# EAGLE design tower controller (EAGLE 9.6.2)
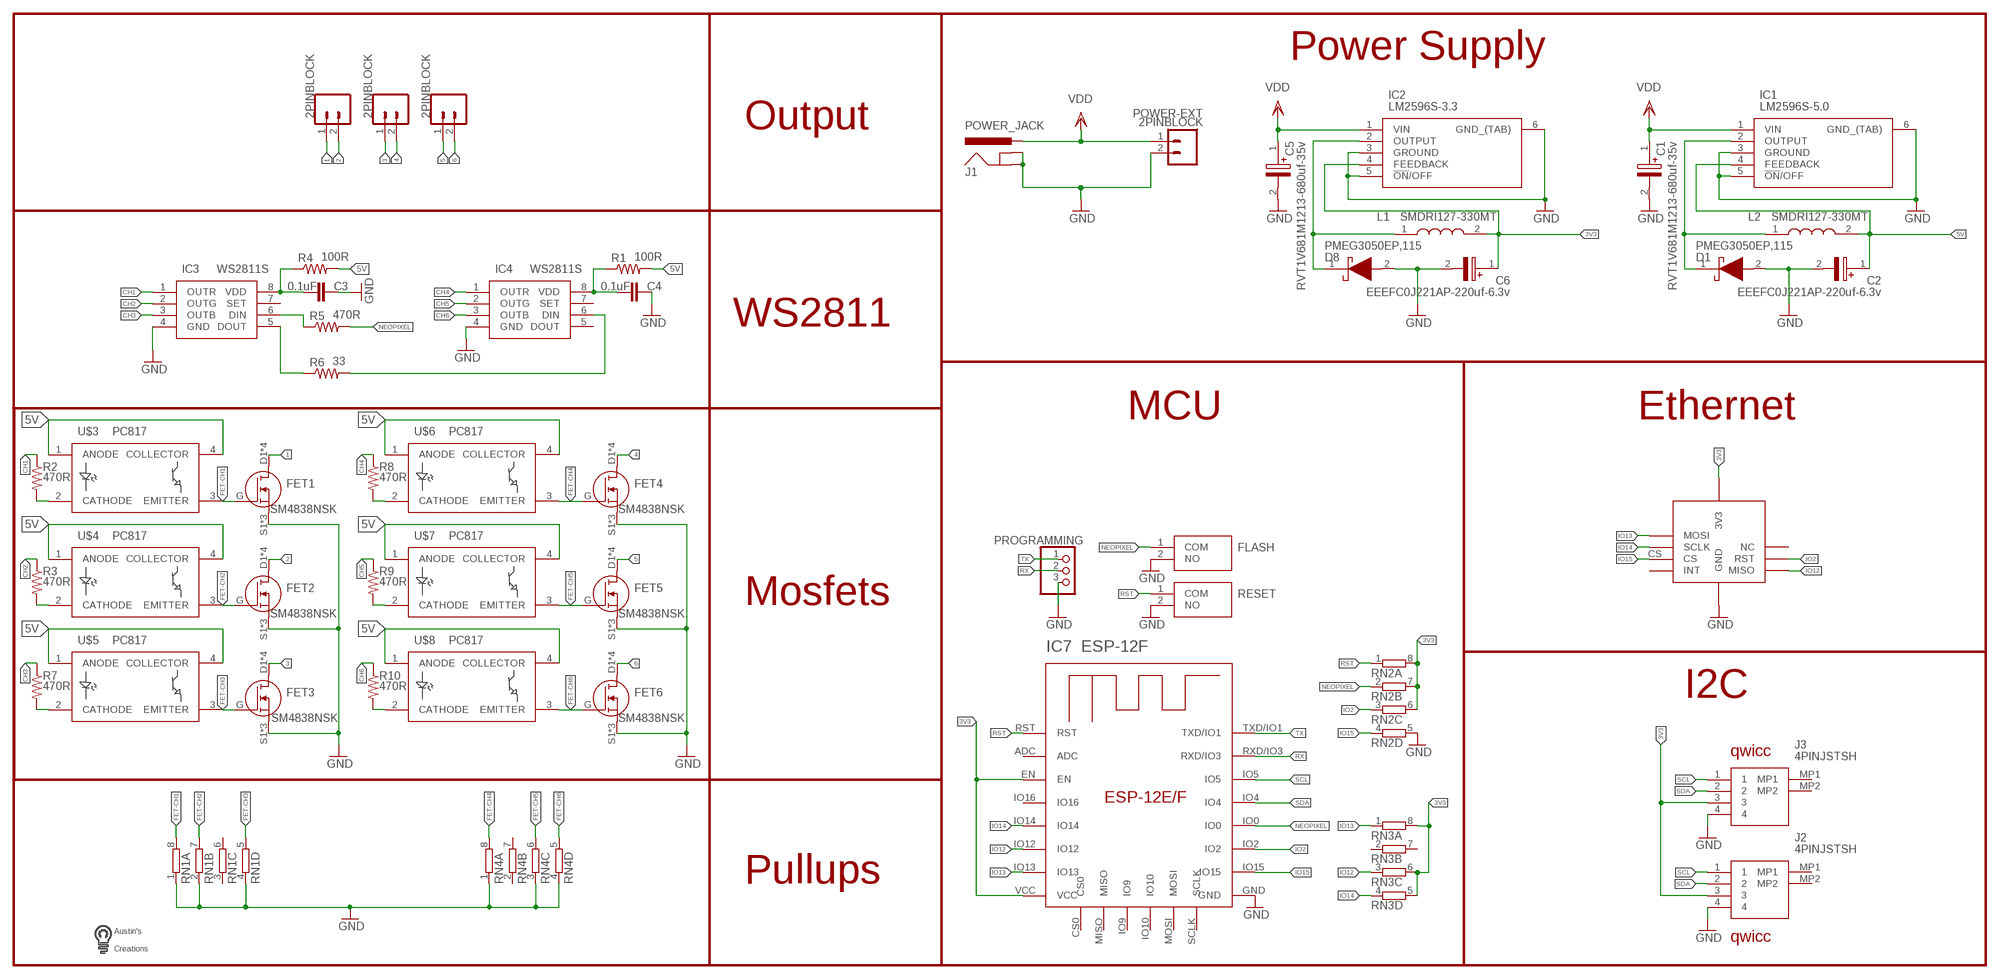
[diagram p0: schematic, sheet 1]

## Parts
C1  RVT1V681M1213-680uf-35v  EEE-HD1V681AQ  [CAPAE1350X1400N]
C2  EEEFC0J221AP-220uf-6.3v  EEEFC0J221AP  [CAPAE830X650N]
C3  0.1uF  C-EUC0603  [C0603]
C4  0.1uF  C-EUC0603  [C0603]
C5  RVT1V681M1213-680uf-35v  EEE-HD1V681AQ  [CAPAE1350X1400N]
C6  EEEFC0J221AP-220uf-6.3v  EEEFC0J221AP  [CAPAE830X650N]
D1  PMEG3050EP,115  [PMEG3050EP115]
D8  PMEG3050EP,115  [PMEG3050EP115]
FET1  SM4838NSK  [SM4838NSK]
FET2  SM4838NSK  [SM4838NSK]
FET3  SM4838NSK  [SM4838NSK]
FET4  SM4838NSK  [SM4838NSK]
FET5  SM4838NSK  [SM4838NSK]
FET6  SM4838NSK  [SM4838NSK]
FLASH  PTS636_SM25F_SMTR_LFS  [PTS636SM25FSMTRLFS]
GND  2PINBLOCK  [SCREWTERMINAL-5MM-2]
GND10  2PINBLOCK  [SCREWTERMINAL-5MM-2]
GND11  2PINBLOCK  [SCREWTERMINAL-5MM-2]
IC1  LM2596S-5.0  LM2596S-3.3_NOPB  [TO170P1435X465-6N]
IC2  LM2596S-3.3  LM2596S-3.3_NOPB  [TO170P1435X465-6N]
IC3  WS2811S  [SOIC127P600X175-8N]
IC4  WS2811S  [SOIC127P600X175-8N]
IC7  ESP-12F  ESP-12E/F  [ESP-12E]
J1  POWER_JACK  [POWER_JACK_PTH]
J2  4PINJSTSH  [665104131822]
J3  4PINJSTSH  [665104131822]
L1  SMDRI127-330MT  CDRH127_LDNP-330MC  [INDPM120120X800N]
L2  SMDRI127-330MT  CDRH127_LDNP-330MC  [INDPM120120X800N]
POWER-EXT  2PINBLOCK  [SCREWTERMINAL-5MM-2]
PROGRAMMING  PINHD-1X3  [1X03]
R1  100R  R-US_R0603  [R0603]
R2  470R  R-US_R0603  [R0603]
R3  470R  R-US_R0603  [R0603]
R4  100R  R-US_R0603  [R0603]
R5  470R  R-US_R0603  [R0603]
R6  33  R-US_R0603  [R0603]
R7  470R  R-US_R0603  [R0603]
R8  470R  R-US_R0603  [R0603]
R9  470R  R-US_R0603  [R0603]
R10  470R  R-US_R0603  [R0603]
RESET  PTS636_SM25F_SMTR_LFS  [PTS636SM25FSMTRLFS]
RN1  4R-N0603-ARC  [0603-ARC]
RN2  4R-N0603-ARC  [0603-ARC]
RN3  4R-N0603-ARC  [0603-ARC]
RN4  4R-N0603-ARC  [0603-ARC]
U$1  W5500MODULE  [W5500MODULE]
U$2  LOGOMED  [LOGOMED]
U$3  PC817  [SOP254P960X420-4N]
U$4  PC817  [SOP254P960X420-4N]
U$5  PC817  [SOP254P960X420-4N]
U$6  PC817  [SOP254P960X420-4N]
U$7  PC817  [SOP254P960X420-4N]
U$8  PC817  [SOP254P960X420-4N]

## Nets
1: FET1.D1(D) FET1.D2(D) FET1.D3(D) FET1.D4(D) GND.1
2: FET2.D1(D) FET2.D2(D) FET2.D3(D) FET2.D4(D) GND.2
3: FET3.D1(D) FET3.D2(D) FET3.D3(D) FET3.D4(D) GND10.1
3V3: C6.1(+) IC2.4(FEEDBACK) IC7.EN IC7.VCC J2.3 J3.3 L1.2 RN2.6 RN2.7 RN2.8 RN3.5 RN3.6 RN3.8 U$1.3V3_1(3V3) U$1.3V3_2(3V3)
4: FET4.D1(D) FET4.D2(D) FET4.D3(D) FET4.D4(D) GND10.2
5: FET5.D1(D) FET5.D2(D) FET5.D3(D) FET5.D4(D) GND11.1
5V: C2.1(+) IC1.4(FEEDBACK) L2.2 R1.2 R4.2 U$3.1(ANODE) U$3.4(COLLECTOR) U$4.1(ANODE) U$4.4(COLLECTOR) U$5.1(ANODE) U$5.4(COLLECTOR) U$6.1(ANODE) U$6.4(COLLECTOR) U$7.1(ANODE) U$7.4(COLLECTOR) U$8.1(ANODE) U$8.4(COLLECTOR)
6: FET6.D1(D) FET6.D2(D) FET6.D3(D) FET6.D4(D) GND11.2
CH1: IC3.1(OUTR) R2.1
CH2: IC3.2(OUTG) R3.1
CH3: IC3.3(OUTB) R7.1
CH4: IC4.1(OUTR) R8.1
CH5: IC4.2(OUTG) R9.1
CH6: IC4.3(OUTB) R10.1
FET-CH1: FET1.G RN1.8 U$3.3(EMITTER)
FET-CH2: FET2.G RN1.7 U$4.3(EMITTER)
FET-CH3: FET3.G RN1.5 U$5.3(EMITTER)
FET-CH4: FET4.G RN4.8 U$6.3(EMITTER)
FET-CH5: FET5.G RN4.6 U$7.3(EMITTER)
FET-CH6: FET6.G RN4.5 U$8.3(EMITTER)
GND: C1.2(-) C2.2(-) C3.1 C4.1 C5.2(-) C6.2(-) D1.2(A) D8.2(A) FET1.S1(S) FET1.S2(S) FET1.S3(S) FET2.S1(S) FET2.S2(S) FET2.S3(S) FET3.S1(S) FET3.S2(S) FET3.S3(S) FET4.S1(S) FET4.S2(S) FET4.S3(S) FET5.S1(S) FET5.S2(S) FET5.S3(S) FET6.S1(S) FET6.S2(S) FET6.S3(S) FLASH.2(NO) IC1.3(GROUND) IC1.5(!ON!/OFF) IC1.6(GND_(TAB)) IC2.3(GROUND) IC2.5(!ON!/OFF) IC2.6(GND_(TAB)) IC3.4(GND) IC4.4(GND) IC7.GND J1.GND J1.GNDBREAK J2.4 J3.4 POWER-EXT.2 PROGRAMMING.3 RESET.2(NO) RN1.1 RN1.2 RN1.4 RN2.5 RN4.1 RN4.3 RN4.4 U$1.GND1(GND) U$1.GND2(GND) U$1.GND3(GND)
IO2: IC7.IO2 RN2.3 U$1.RST
IO12: IC7.IO12 RN3.3 U$1.MISO
IO13: IC7.IO13 RN3.1 U$1.MOSI
IO14: IC7.IO14 RN3.4 U$1.SCLK
IO15: IC7.IO15 RN2.4 U$1.CS
N$1: D1.1(K) IC1.2(OUTPUT) L2.1
N$2: C4.2 IC4.8(VDD) R1.1
N$3: IC4.6(DIN) R6.2
N$4: C3.2 IC3.8(VDD) R4.1
N$5: IC3.6(DIN) R5.1
N$6: IC3.5(DOUT) R6.1
N$8: R3.2 U$4.2(CATHODE)
N$9: R2.2 U$3.2(CATHODE)
N$11: R7.2 U$5.2(CATHODE)
N$13: R8.2 U$6.2(CATHODE)
N$15: R9.2 U$7.2(CATHODE)
N$17: R10.2 U$8.2(CATHODE)
N$20: D8.1(K) IC2.2(OUTPUT) L1.1
NEOPIXEL: FLASH.1(COM) IC7.IO0 R5.2 RN2.2
RST: IC7.RST RESET.1(COM) RN2.1
RX: IC7.RXD/IO3 PROGRAMMING.2
SCL: IC7.IO5 J2.1 J3.1
SDA: IC7.IO4 J2.2 J3.2
TX: IC7.TXD/IO1 PROGRAMMING.1
VDD: C1.1(+) C5.1(+) IC1.1(VIN) IC2.1(VIN) J1.PWR POWER-EXT.1
Unconnected: IC3.7(SET) IC4.5(DOUT) IC4.7(SET) IC7.ADC IC7.CS0 IC7.IO9 IC7.IO10 IC7.IO16 IC7.MISO IC7.MOSI IC7.SCLK J2.MP1 J2.MP2 J3.MP1 J3.MP2 RN1.3 RN1.6 RN3.2 RN3.7 RN4.2 RN4.7 U$1.INT U$1.NC

## Notes on the sheet
- Power Supply
- Output
- WS2811
- MCU | Ethernet
- Mosfets
- I2C
- qwicc
- Pullups
- qwicc

## Library data of the parts
C1 C5 = SamacSys_Parts:EEE-HD1V681AQ: Aluminium Electrolytic Capacitors - SMD 35VDC 680uF 20% AEC-Q200 Source: Datasheet <https://industrial.panasonic.com/cdbs/www-data/pdf/RDE0000/ABA0000C1166.pdf>; DESCRIPTION: Aluminium Electrolytic Capacitors - SMD 35VDC 680uF 20% AEC-Q200; HEIGHT: 14mm; MANUFACTURER_NAME: Panasonic; MANUFACTURER_PART_NUMBER: EEE-HD1V681AQ; MOUSER_PART_NUMBER: 667-EEE-HD1V681AQ; MOUSER_PRICE-STOCK: https://www.mouser.co.uk/ProductDetail/Panasonic/EEE-HD1V681AQ?qs=w%2Fv1CP2dgqoW7i2Hoqi%252B9w%3D%3D
C2 C6 = SamacSys_Parts:EEEFC0J221AP: PANASONIC - EEEFC0J221AP - SMD Aluminium Electrolytic Capacitor, Radial Can - SMD, 220 F, 6.3 V, EEEFC Series Source: Datasheet <https://industrial.panasonic.com/cdbs/www-data/pdf/RDE0000/ABA0000C1169.pdf>; DESCRIPTION: PANASONIC - EEEFC0J221AP - SMD Aluminium Electrolytic Capacitor, Radial Can - SMD, 220 F, 6.3 V, EEEFC Series; HEIGHT: 6.5mm; MANUFACTURER_NAME: Panasonic; MANUFACTURER_PART_NUMBER: EEEFC0J221AP
C3 C4 = rcl:C-EU: CAPACITOR, European symbol; SPICEPREFIX: C
D1 D8 = SamacSys_Parts:PMEG3050EP,115: NXP PMEG3050EP,115 SMT Schottky Diode, 30V 5A, 2-Pin SOD-128 Source: Datasheet <https://docs-emea.rs-online.com/webdocs/14cd/0900766b814cd012.pdf>; ARROW_PART_NUMBER: PMEG3050EP,115; ARROW_PRICE-STOCK: https://www.arrow.com/en/products/pmeg3050ep115/nexperia; DESCRIPTION: NXP PMEG3050EP,115 SMT Schottky Diode, 30V 5A, 2-Pin SOD-128; HEIGHT: 1mm; MANUFACTURER_NAME: Nexperia; MANUFACTURER_PART_NUMBER: PMEG3050EP,115; MOUSER_PART_NUMBER: 771-PMEG3050EP115; MOUSER_PRICE-STOCK: https://www.mouser.co.uk/ProductDetail/Nexperia/PMEG3050EP115?qs=GcY6OjH1zdmnjQ%2FhUT5aOA%3D%3D
FET1-FET6 = custom parts:SM4838NSK: N channel mosfet 30v 10a SOP-8
FLASH RESET = SamacSys_Parts:PTS636_SM25F_SMTR_LFS: Tactile Switches Tact 50mA 12VDC, 6.0x3.5, 2.5mm H, 180gf, F leads, No ground pin, White Actuator Source: Datasheet <https://ms.componentsearchengine.com/Datasheets/1/PTS636 SM25F SMTR LFS.pdf>; ARROW_PART_NUMBER: PTS636 SM25F SMTR LFS; ARROW_PRICE-STOCK: https://www.arrow.com/en/products/pts636-sm25f-smtr-lfs/ck; DESCRIPTION: Tactile Switches Tact 50mA 12VDC, 6.0x3.5, 2.5mm H, 180gf, F leads, No ground pin, White Actuator; HEIGHT: 2.7mm; MANUFACTURER_NAME: C & K COMPONENTS; MANUFACTURER_PART_NUMBER: PTS636 SM25F SMTR LFS; MOUSER_PART_NUMBER: 611-PTS636SM25FSMTRL; MOUSER_PRICE-STOCK: https://www.mouser.co.uk/ProductDetail/CK/PTS636-SM25F-SMTR-LFS?qs=vLWxofP3U2wcBTQSwfMFOw%3D%3D
GND GND10 GND11 POWER-EXT = custom parts:2PINBLOCK
IC1 IC2 = SamacSys_Parts:LM2596S-3.3_NOPB: SIMPLE SWITCHER® 4.5V to 40V, 3A Low Component Count Step-Down Regulator Source: Datasheet <http://www.ti.com/lit/ds/symlink/lm2596.pdf>; DESCRIPTION: SIMPLE SWITCHER&#174; 4.5V to 40V, 3A Low Component Count Step-Down Regulator; HEIGHT: 4.65mm; MANUFACTURER_NAME: Texas Instruments; MANUFACTURER_PART_NUMBER: LM2596S-3.3/NOPB; MOUSER_PART_NUMBER: 926-LM2596S-3.3/NOPB; MOUSER_PRICE-STOCK: https://www.mouser.co.uk/ProductDetail/Texas-Instruments/LM2596S-33-NOPB?qs=X1J7HmVL2ZHsEwG9Q6doow%3D%3D
IC3 IC4 = SamacSys_Parts:WS2811S: RGB led driver Source: Datasheet <https://cdn-shop.adafruit.com/datasheets/WS2811.pdf>; DESCRIPTION: RGB led driver; HEIGHT: 1.75mm; MANUFACTURER_NAME: Worldsemi; MANUFACTURER_PART_NUMBER: ws2811s
IC7 = custom parts:ESP-12E/F
J1 = custom parts:POWER_JACK: Power Jack Connector This is the standard 5.5mm barrel jack for power. The PTH is the most common, proven, reliable, footprint. The Slot footprint only works if the mill layer is transmitted to the PCB fab house so be warned. Here are the connectors we sell at SparkFun: DC Barrel Power Jack/Connector <https://www.sparkfun.com/products/119> (PRT-00119) DC Barrel Power Jack/Connector (SMD) <https://www.sparkfun.com/products/12748> (PRT-12748) DC Barrel Jack Adapter - Breadboard Compatible <https://www.sparkfun.com/products/10811> (PRT-10811) It is used on this SparkFun product (and many, many others): SparkFun RedBoard - Programmed with Arduino <https://www.sparkfun.com/products/12757> (DEV-12757) Also, if you need a mating power supply or connector, please check these out: Wall Adapter Power Supply - 9VDC 650mA <https://www.sparkfun.com/products/298> (TOL-00298) DC Barrel Jack Adapter - Male <https://www.sparkfun.com/products/10287> (PRT-10287); PROD_ID: CONN-08197
J2 J3 = SamacSys_Parts:4PINJSTSH: Wurth Elektronik WR-WTB 6651, 1mm Pitch, 4 Way, 1 Row Header, Surface Mount Source: Datasheet <http://katalog.we-online.de/em/datasheet/6651xx131822.pdf>; DESCRIPTION: Wurth Elektronik WR-WTB 6651, 1mm Pitch, 4 Way, 1 Row Header, Surface Mount; HEIGHT: 3.3mm; MANUFACTURER_NAME: Wurth Elektronik; MANUFACTURER_PART_NUMBER: 665104131822; MOUSER_PART_NUMBER: 710-665104131822; MOUSER_PRICE-STOCK: https://www.mouser.co.uk/ProductDetail/Wurth-Elektronik/665104131822?qs=a9WhcLg8qCxe2o4Xu%2FqBdg%3D%3D
L1 L2 = SamacSys_Parts:CDRH127_LDNP-330MC: Fixed Inductors 33uH 3.9A Source: Datasheet <https://products.sumida.com/products/pdf/CDRH127LD.pdf>; DESCRIPTION: Fixed Inductors 33uH 3.9A; HEIGHT: 8mm; MANUFACTURER_NAME: Sumida; MANUFACTURER_PART_NUMBER: CDRH127/LDNP-330MC; MOUSER_PART_NUMBER: 851-CDRH127LDNP330MC; MOUSER_PRICE-STOCK: https://www.mouser.co.uk/ProductDetail/Sumida/CDRH127-LDNP-330MC?qs=rZntyWl5IYHj3wgmnQ0WOg%3D%3D
PROGRAMMING = custom parts:PINHD-1X3: PIN HEADER
R1-R10 = resistor:R-US_: RESISTOR, American symbol
RN1-RN4 = custom parts:4R-N: Array Chip Resistor Source: RS Component / Phycomp; OC_FARNELL: unknown; OC_NEWARK: unknown
U$1 = custom parts:W5500MODULE
U$2 = custom parts:LOGOMED
U$3-U$8 = custom parts:PC817

## Board
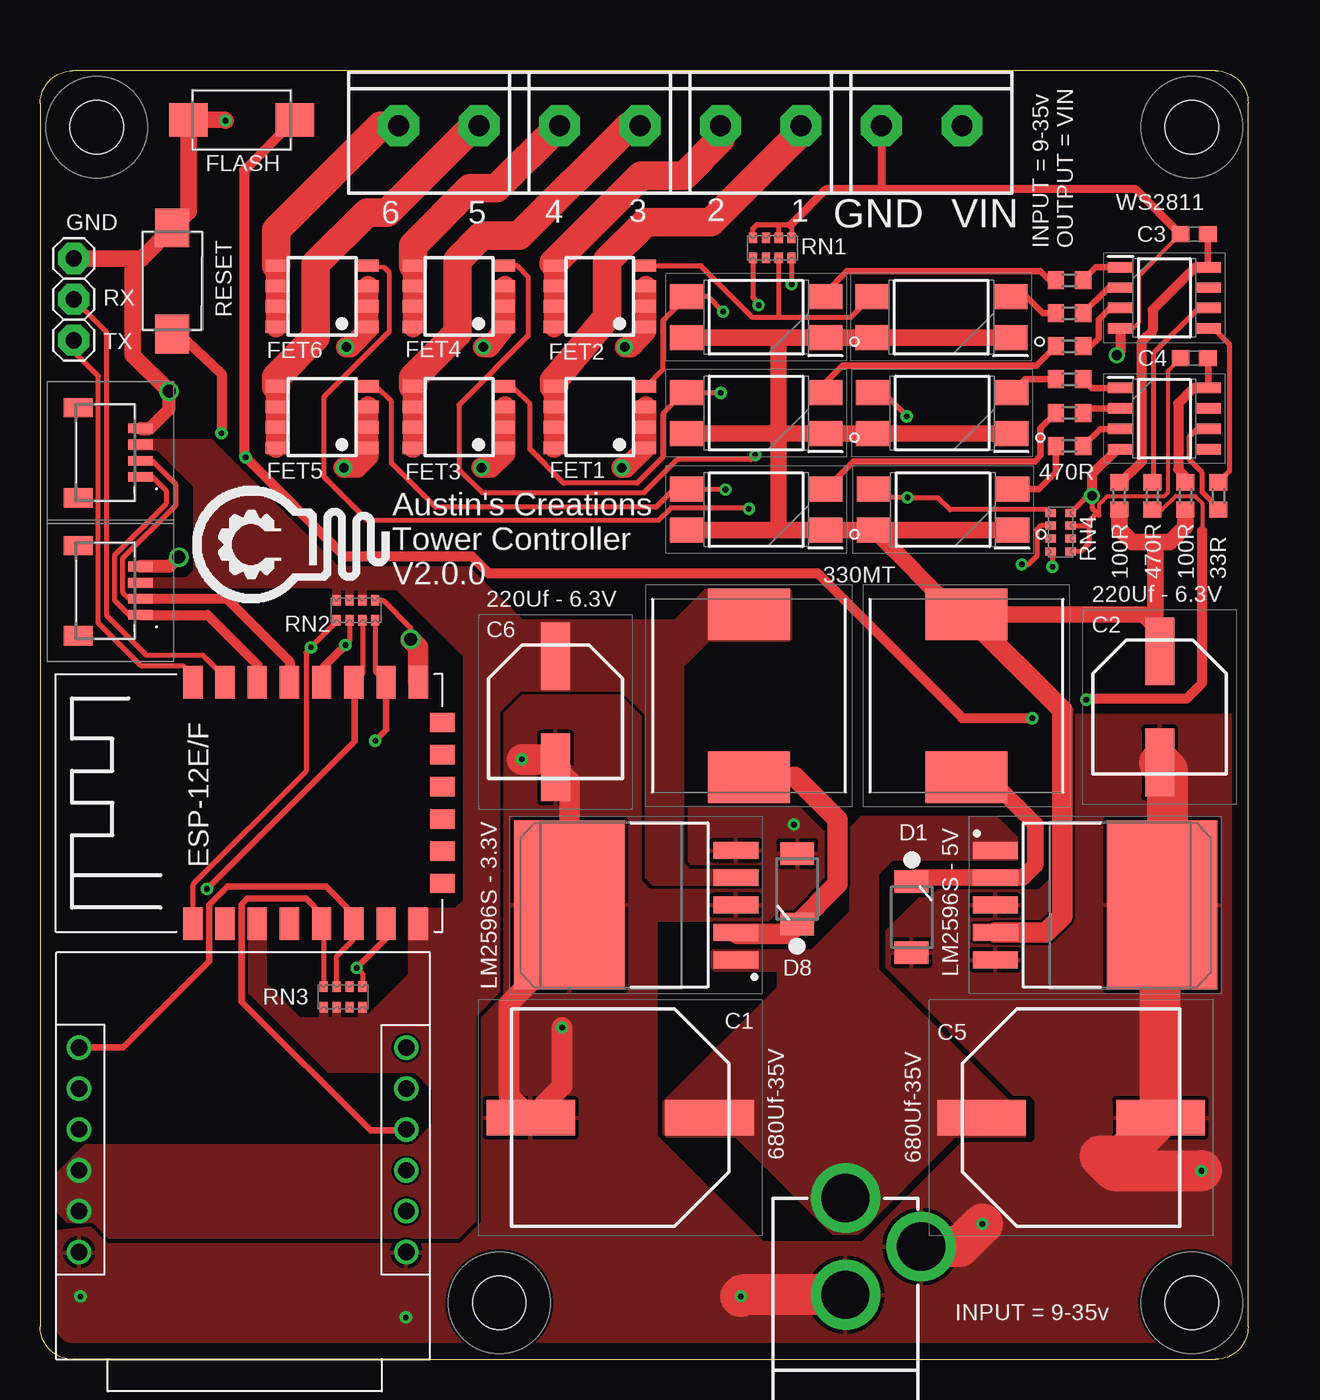
[diagram p1: board, top side]
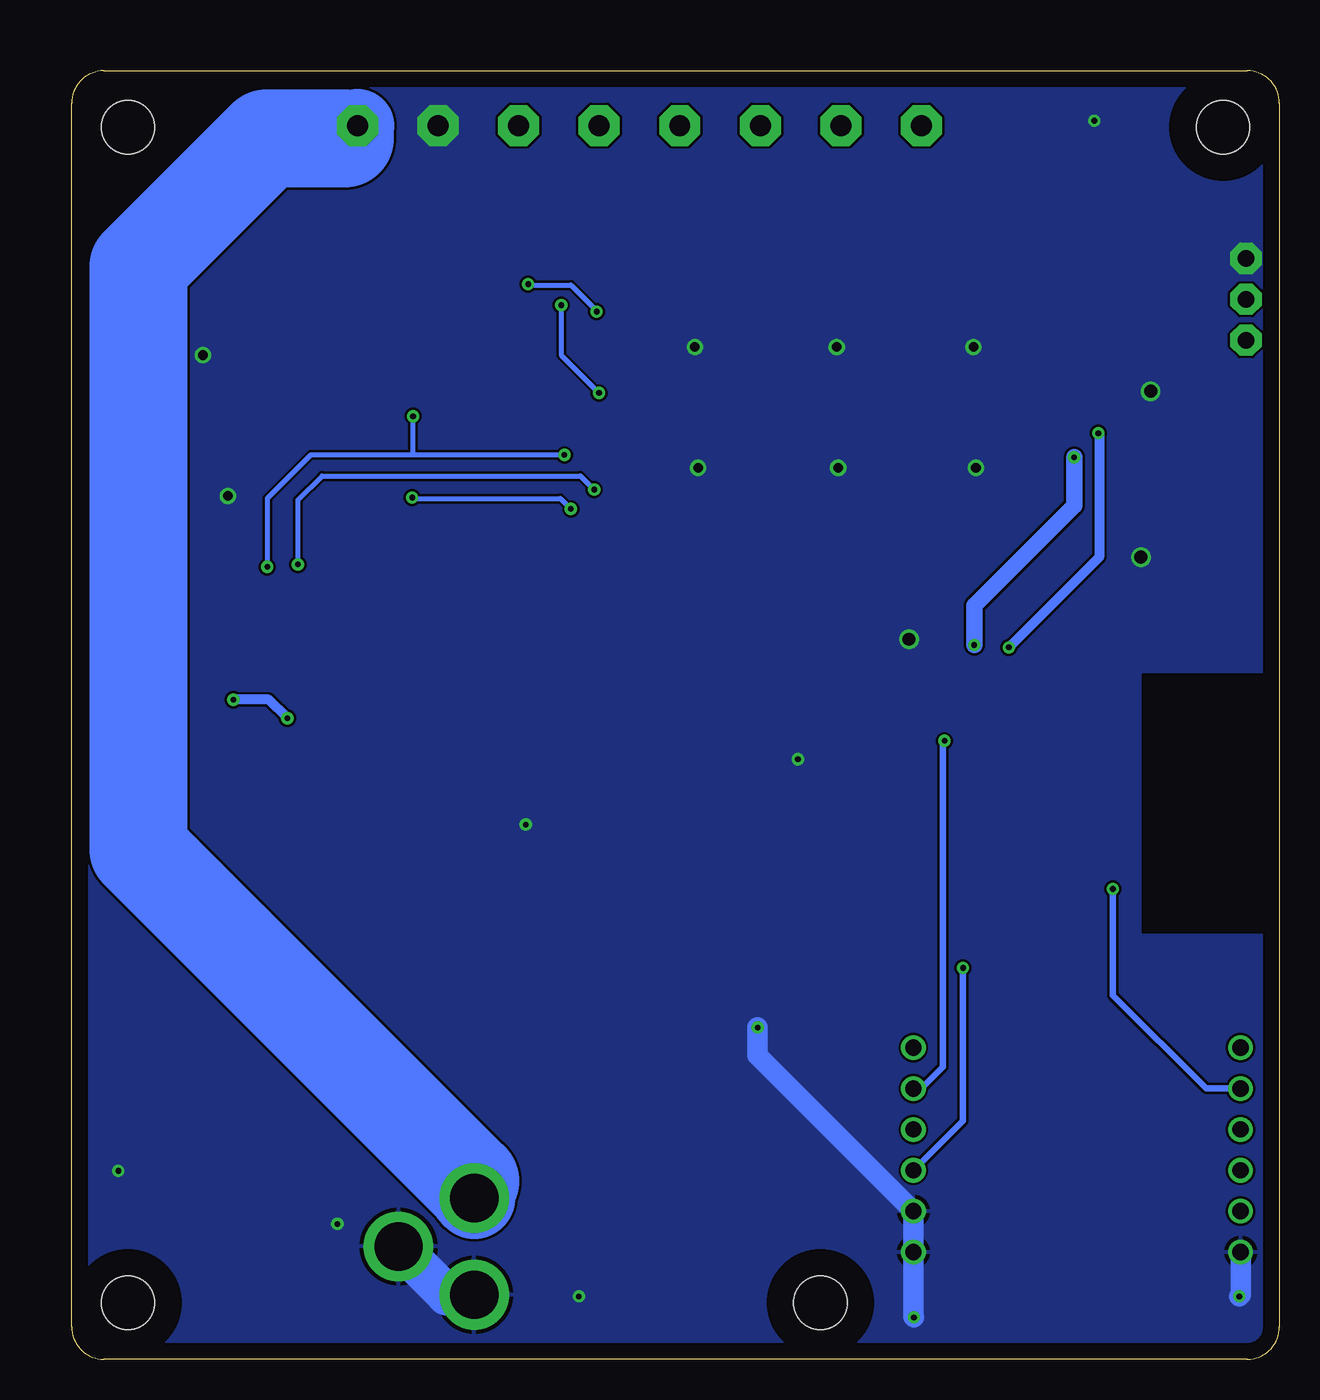
[diagram p2: board, bottom side, seen from below]

Size 75 x 80 mm. Coordinates in mm from the lower left corner, seen from the top.
Outline: 2,0 73,0 arc90 75,2 75,78 arc90 73,80 2,80 arc90 0,78 0,2 arc90 2,0
Copper layers (1*16): Top 0.035mm / dielectric 1.5mm / Bottom 0.035mm
Design rules "default": minimum track width 6mil, minimum drill 0.35mm, track to track 6mil, track to pad 6mil, pad to pad 6mil, via to via 6mil, smd to smd 6mil, copper to edge 40mil, drill to drill 6mil, minimum pad ring 10mil, minimum via ring 8mil, stop-mask expansion 4mil, vias tented up to drill 0mil, thermal gap 10mil
Holes 3.3 mm at 28.5,3.5 71.5,3.5 3.5,76.5 71.5,76.5
tRestrict: area 0,26.5 to 8.5,42.5; area 25.3,0.3 to 31.7,6.7; area 68.3,0.3 to 74.7,6.7
bRestrict: area 0,26.5 to 8.5,42.5; area 25.3,0.3 to 31.7,6.7; area 68.3,0.3 to 74.7,6.7; area 0.3,73.3 to 6.7,79.7

### Footprints (pad centres in the part's own frame; a part is rotated, then mirrored left to right if it is on the bottom)
CAPAE1350X1400N = smd 5.5 x 2.2: 1 -5.55,0; 2 5.55,0
CAPAE830X650N = smd 4.2 x 1.8: 1 -3.45,0; 2 3.45,0
C0603 = smd 1.1 x 1: 1 -0.85,0; 2 0.85,0
PMEG3050EP115 = smd 1.4 x 2.1: 1 -2.2,0; 2 2.2,0
SM4838NSK = smd 0.76 x 1.27: D1 -1.905,2.86; D2 -0.635,2.86; D3 0.635,2.86; D4 1.905,2.86; G 1.905,-2.86; S1 -1.905,-2.86; S2 -0.635,-2.86; S3 0.635,-2.86
PTS636SM25FSMTRLFS = smd 2.4 x 2.1: 1 -3.3,0; 2 3.3,0
SCREWTERMINAL-5MM-2 = drill 1.3 pad 2.54 octagon: 1 -2.54,0; 2 2.46,0
TO170P1435X465-6N = smd 2.8 x 1.05: 1 -6.2,3.4; 2 -6.2,1.7; 3 -6.2,0; 4 -6.2,-1.7; 5 -6.2,-3.4 | smd 6.85 x 10.5: 6 4.15,0
SOIC127P600X175-8N = smd 1.55 x 0.65: 1 -2.725,1.905; 2 -2.725,0.635; 3 -2.725,-0.635; 4 -2.725,-1.905; 5 2.725,-1.905; 6 2.725,-0.635; 7 2.725,0.635; 8 2.725,1.905
ESP-12E = smd 2 x 1.2: ADC -7.46,5.53; EN -7.46,3.53; GND 7.54,-6.47; IO0 7.54,-0.47; IO2 7.54,-2.47; IO4 7.54,1.53; IO5 7.54,3.53; IO12 -7.46,-2.47; IO13 -7.46,-4.47; IO14 -7.46,-0.47; IO15 7.54,-4.47; IO16 -7.46,1.53; RST -7.46,7.53; RXD/IO3 7.54,5.53; TXD/IO1 7.54,7.53; VCC -7.46,-6.47 | smd 1.2 x 1.5: CS0 -4.96,-7.97; IO9 -0.96,-7.97; IO10 1.04,-7.97; MISO -2.96,-7.97; MOSI 3.04,-7.97; SCLK 5.04,-7.97
POWER_JACK_PTH = drill 2.997 pad 4.318: GND 0,7.7; GNDBREAK 4.7,10.7; PWR 0,13.7
665104131822 = smd 0.6 x 1.55: 1 -3,0; 2 -2,0; 3 -1,0; 4 0,0 | smd 1.2 x 1.8: MP1 -4.3,3.875; MP2 1.3,3.875
INDPM120120X800N = smd 3.2 x 5.1: 1 -5.05,0; 2 5.05,0
1X03 = drill 1.016 pad 1.93 octagon: 1 -2.54,0; 2 0,0; 3 2.54,0
R0603 = smd 1 x 1.1: 1 -0.85,0; 2 0.85,0
0603-ARC = smd 0.5 x 0.65: 1 -1.2,-0.625; 2 -0.4,-0.625; 3 0.4,-0.625; 4 1.2,-0.625; 5 1.2,0.625; 6 0.4,0.625; 7 -0.4,0.625; 8 -1.2,0.625
W5500MODULE = drill 1.016: 3V3_1 21.79,-9.19; 3V3_2 21.79,-11.73; CS 1.47,-16.81; GND1 21.79,-6.65; GND2 1.47,-6.65; GND3 1.47,-9.19; INT 1.47,-19.35; MISO 21.79,-19.35; MOSI 1.47,-11.73; NC 21.79,-14.27; RST 21.79,-16.81; SCLK 1.47,-14.27
SOP254P960X420-4N = smd 2.1 x 1.55: 1 -4.3,1.27; 2 -4.3,-1.27; 3 4.3,-1.27; 4 4.3,1.27

### Placement (x,y rotation side)
C1  36,15 180 top
C2  69.5,40.5 270 top
C3  71.65,69.85 0 top
C4  71.65,62.15 0 top
C5  64,15 0 top
C6  32,40.2 270 top
D1  54.1,27.45 270 top
D8  47,29.2 90 top
FET1  34.75,58.5 90 top
FET2  34.75,66 90 top
FET3  26,58.5 90 top
FET4  26,66 90 top
FET5  17.5,58.5 90 top
FET6  17.5,66 90 top
FLASH  12.5,76.95 180 top
GND  44.7,76.6 180 top
GND10  34.7,76.6 180 top
GND11  24.7,76.6 180 top
IC1  65.5,28.2 0 top
IC2  37,28.2 180 top
IC3  69.8,65.9 0 top
IC4  69.8,58.4 0 top
IC7  17,34.5 90 top
J1  50,-3.7 0 top
J2  6.22,49.22 90 top
J3  6.22,57.79 90 top
L1  44,41.2 90 top
L2  57.5,41.2 90 top
POWER-EXT  54.7,76.6 180 top
PROGRAMMING  2.08,65.81 90 top
R1  71.1,53.6 270 top
R2  63.9,67 180 top
R3  63.9,64.95 180 top
R4  67,53.6 270 top
R5  69.05,53.6 270 top
R6  73.15,53.6 270 top
R7  63.9,62.9 180 top
R8  63.9,60.85 180 top
R9  63.9,58.75 180 top
R10  63.9,56.7 180 top
RESET  8.2,66.95 90 top
RN1  45.45,69 180 top
RN2  19.6,46.5 0 top
RN3  18.8,22.5 180 top
RN4  63.35,51.35 90 top
U$1  24.2,0 180 top
U$2  22,46.3 90 top
U$3  44.45,64.7 180 top
U$4  55.95,64.7 180 top
U$5  44.45,58.75 180 top
U$6  56,58.75 180 top
U$7  44.45,52.75 180 top
U$8  56.05,52.75 180 top

### Tracks (layer width: path | path; a pad name or v marks a point on that pad's centre or on a via)
1
  Top 1.27: FET1.D4 FET1.D3 FET1.D2 FET1.D1
  Top 1.778: FET1.D4 31.89,60.76 35.2,64.72 35.2,68.2 37.6,70.6 41.64,70.6 47.24,76.2 GND.1
2
  Top 1.016: 31.87,68.07 FET2.D4
  Top 1.27: FET2.D4 FET2.D3 FET2.D2 FET2.D1
  Top 1.778: GND.2 42.24,75.75 39.99,73.5 37.3,73.5 31.87,68.07
3
  Top 1.27: FET3.D4 FET3.D3 FET3.D2 FET3.D1
  Top 1.778: GND10.1 36.59,76.6 29.74,69.75 27.4,69.75 25.9,68.25 25.9,63.72 23.14,60.95 FET3.D4
3V3
  pour Top (no thermals): 44.5,30.4 44.5,29.45 38.05,29.45 37.6,29.9 37.6,40 36.1,41.5 29.8,41.5 28.5,40.2 28.5,22.8 27,21.3 27,8.6 25.95,7.55 4.25,7.55 3.3,8.5 1.7,8.5 1.05,9.15 1.05,11.55 2.8,13.3 23.1,13.3 24.4,14.6 24.4,16.7 23.3,17.8 17.9,17.8 13,22.7 13,27.2 13.3,27.5 13.9,27.5 14,27.4 14,23.3 16.1,21.2 17.3,21.2 17.4,21.3 17.4,22.1 17.8,22.1 17.8,21.2 18.2,21.2 18.2,22.1 18.6,22.1 18.6,21.2 19.8,21.2 19.8,22.1 20.2,22.1 20.2,21.2 22.9,23.9 22.9,28 25.8,28 26.3,28.5 26.3,43.65 22.15,47.8 20.2,47.8 20.2,46.9 19.8,46.9 19.8,47.8 19.4,47.8 19.4,46.9 19,46.9 19,47.8 18.6,47.8 18.6,46.9 18.2,46.9 18.2,47.8 18.1,47.9 5.5,47.9 5.5,48.5 9.1,48.5 9.6,49 9.6,54.15 7.3,56.45 5.6,56.45 5.6,57.1 10.6,57.1 18.5,49.2 26.6,49.2 29.9,45.9 39.4,45.9 41.3,47.8 46.5,47.8 46.6,47.7 46.6,44.7 46.5,44.6 41.5,44.6 39.9,43 39.9,30.8 40.3,30.4
4
  Top 1.27: FET4.D4 FET4.D3 FET4.D2 FET4.D1
  Top 1.778: FET4.D4 23.14,69.16 26.68,72.7 28.34,72.7 GND10.2
5
  Top 1.27: FET5.D4 FET5.D3 FET5.D2 FET5.D1
  Top 1.778: GND11.1 26.94,76.6 21.54,71.2 20.29,71.2 17.1,68.01 17.1,63.45 14.64,60.99 FET5.D4
5V
  Top 0.61: L2.2 56.98,46.25 | 45.85,57.38 45.75,57.48 | 45.85,63.38 45.9,63.43
  Top 1.016: U$3.4 45.9,63.43 U$3.1 U$4.4 U$4.1 | U$5.4 45.75,57.48 U$5.1 U$6.4 U$6.1 | U$7.4 45.85,51.48 | 45.85,51.48 U$7.1 U$8.4 | U$8.4 U$8.1 | L2.2 68.5,46.25 69.5,45.25 C2.1 69.25,44.2 69.25,50.75 | 56.98,46.25 U$8.4 | 45.85,51.48 45.85,57.38 45.85,63.38 | R4.2 67,51.55 67.8,50.75 69.25,50.75 | 69.25,50.75 70.15,50.75 71.1,51.7 R1.2
  Top 1.27: IC1.4 62.45,26.5 63.45,27.5 63.45,40.3 L2.2
6
  Top 1.27: FET6.D4 FET6.D3 FET6.D2 FET6.D1
  Top 1.778: FET6.D4 14.64,70.1 21.14,76.6 GND11.2
CH1
  Top 0.406: IC3.1 65.56,67.81 R2.1
CH2
  Top 0.406: IC3.2 66.33,66.53 R3.1
CH3
  Top 0.406: IC3.3 66.42,65.27 65.72,64.56 65.72,63.41 65.21,62.9 R7.1
CH4
  Top 0.406: IC4.1 65.3,60.3 R8.1
CH5
  Top 0.406: R9.1 65.03,59.03 IC4.2
CH6
  Top 0.406: IC4.3 65.81,57.77 R10.1
FET-CH1  (via drill 0.35)
  Top 0.305: RN1.8 v46.65,66.75 | v42.4,65.05 41.48,65.97 U$3.3 38.65,64.47 38.65,61.45 FET1.G
  Bottom 0.305: v46.65,66.75 46.6,66.7 44,66.7 42.4,65.1 v42.4,65.05
FET-CH2
  Top 0.305: 45.85,64.7 44.2,64.7 40.99,67.91 FET2.G | 45.85,64.7 50.35,64.7 51.62,65.97 U$4.3 | RN1.7 45.85,64.7
FET-CH3  (via drill 0.35)
  Top 0.305: FET3.G 28.88,60.39 29.31,60.39 30.4,59.3 30.4,56.5 32.5,54.4 37.06,54.4 38.65,55.99 38.65,58.67 40,60.02 U$5.3 40.17,60 v42.25,60 | v44.6,65.45 44.6,65.58 44.25,65.92 RN1.5
  Bottom 0.305: v44.6,65.45 44.6,62.35 v42.25,60
FET-CH4  (via drill 0.35)
  Top 0.305: v44.4,56.15 44.1,55.85 39.55,55.85 37.5,53.8 27.45,53.8 26,55.25 26,59.25 30.3,63.55 30.3,67.2 29.59,67.91 FET4.G | U$6.3 52.35,60.02 53.8,58.57 v53.8,58.55 | RN4.8 62.85,50.02 v62.85,49.2
  Bottom 0.305: v44.4,56.15 53.8,56.15 | v62.85,49.2 62.85,53.45 60.15,56.15 53.8,56.15 | 53.8,56.15 v53.8,58.55
FET-CH5  (via drill 0.35)
  Top 0.305: FET5.G 20.84,60.41 21.8,59.45 21.8,55.64 24.54,52.9 38.23,52.9 39.35,54.02 U$7.3 42.53,54.02 v42.55,54 | v60.95,49.35 61.35,49.35 61.88,49.88 61.88,51.5 62.12,51.75 RN4.6
  Bottom 0.305: v60.95,49.35 60.95,53.35 59.45,54.85 43.4,54.85 v42.55,54
FET-CH6  (via drill 0.35)
  Top 0.305: FET6.G 21.34,67.81 21.65,67.5 21.65,63.8 17.6,59.75 17.6,54.8 20.3,52.1 38.4,52.1 39.15,52.85 43.95,52.85 v44,52.8 | U$8.3 52.27,53.5 v53.85,53.5 55.75,53.5 56.5,52.75 62.52,52.75 RN4.5
  Bottom 0.305: v53.85,53.5 53.8,53.45 44.65,53.45 v44,52.8
GND  (via drill 0.35, 0.6, 0.8)
  Top 0.254: C4.1 70,61.35 70,53.8 69.77,53.57 66.23,53.57 65.75,53.09 65.75,52.4 | C3.1 68.2,67.25 68.2,64.35 67.84,63.99 IC3.4
  Top 0.305: RN2.5 21.27,47.12 23,45.4 v23,44.7 | RN1.4 44.25,70.2 44.5,70.45 45.7,70.45 | 45.7,70.45 45.85,70.3 RN1.2 | 45.7,70.45 46.45,70.45 | 46.45,70.45 46.65,70.25 RN1.1 | 46.6,70.45 46.45,70.45 | RN4.4 65.03,53.6 v65.3,53.6 65.3,52.85 65.6,52.55 | 65.6,52.55 65.75,52.4 | RN4.3 65.1,51.75 | 65.6,52.55 65.1,52.05 65.1,51.75 | 65.1,51.75 65.1,50.65 64.6,50.15 RN4.1
  Top 0.508: POWER-EXT.2 52.24,72.64 | 52.24,72.64 68.01,72.64 C3.1 | 52.24,72.64 48.79,72.64 46.6,70.45
  Top 0.61: IC4.4 66.84,56.49 65.3,54.95 v65.3,53.6 | IC3.4 67.08,62.62 66.85,62.4 v66.85,62.35
  Top 0.813: v8.6,49.8 8.02,49.22 J2.4 | J3.4 6.79,57.79 8,59 v8,60.1
  Top 1.016: PROGRAMMING.3 5.75,68.35 | 5.75,68.35 6.3,68.35 RESET.2 9.2,71.25 FLASH.2 11.45,76.95 v11.5,76.9 | 5.75,68.35 5.75,62.35 v8,60.1
  Top 1.27: IC7.GND 23.47,44.23 v23,44.7 | v32.4,20.6 32.4,16.95 C1.2 29.1,16.35 29.1,22.1 32.85,25.85 IC2.6 32.85,35.9 C6.2 | FET1.S3 FET1.S2 FET1.S1 36.37,55.35 v36.1,55.35 | FET2.S3 FET2.S2 FET2.S1 37.61,63.84 36.69,62.85 v36.3,62.85 | FET4.S3 FET4.S2 FET4.S1 27.89,62.85 v27.5,62.85 | FET3.S3 FET3.S2 FET3.S1 28.86,56.21 28,55.35 v27.4,55.35 | FET5.S3 FET5.S2 FET5.S1 20.36,56.05 19.66,55.35 v18.85,55.35 | FET6.S3 FET6.S2 FET6.S1 20.36,63.95 19.27,62.85 v19,62.85
  Top 1.905: C6.2 31.5,37.25 v29.9,37.25
  Top 2.54: J1.GND 43.6,4 v43.5,3.9 | J1.GNDBREAK 57.1,7 v58.5,8.4 | v72.1,11.7 66.7,11.7 65.8,12.6 67.15,12.6 C5.2 69.55,28.15 70,28.6 70,36.55 C2.2
  Bottom 1.27: U$1.GND1 2.41,3.99 v2.5,3.9 | v22.7,2.6 22.73,2.63 U$1.GND2 U$1.GND3 32.4,18.86 v32.4,20.6
  Bottom 2.54: J1.GND 51.7,4 J1.GNDBREAK
  other vias: 46.8,33.2
  pour Bottom (no thermals): 1.5,69.8 0.9,69.2 0.9,67.6 1.5,67 1.6,67.1 2.9,67.1 3.3,67.5 3.3,68 3.3,69 2.5,69.8
  pour Top: 0.05,7.86 0.05,0.05 74,0.05 74.95,1 74.95,40 62.85,40 62.85,29.95 62,29.1 55.7,29.1 55.2,28.6 54.55,28.6 52.5,26.55 52.5,24.35 60.4,16.45 61.4,16.45 61.8,16.05 61.8,13.65 61.55,13.4 57.2,13.4 51.05,7.25 44.9,7.25 38.3,13.85 38.3,28.7 37.3,29.7 37.3,39.9 36,41.2 29.9,41.2 28.8,40.1 28.8,22.6 27.4,21.2 27.4,8.5 26.05,7.15 4.15,7.15 3.12,8.18
  pour Bottom: 0,8.25 0,77.6 arc-90 2.4,80 3.55,80 73.1,80 arc-90 75,78.1 75,77.15 75,4.05 75,2 arc-90 73,0 72.6,0 2.25,0 2.1,0 arc-90 0,2.1 0,2.3
  pour Bottom (no thermals): 49.8,78.8 49.8,73.85 54.1,73.85 54.5,73.85 54.5,77.95 54.5,78.8
  pour Top: 40.25,34.3 40.25,30.9 40.4,30.75 44.85,30.75 44.85,29.15 37.25,29.15 37.25,27.45 37.45,27.25 45.2,27.25 45.8,27.85 46.6,27.85 48.7,29.95 48.7,32.7 47.1,34.3
IO2  (via drill 0.35)
  Top 0.305: IC7.IO2 19.52,42.09 20,42.57 RN2.3
  Top 0.406: v10.35,29.2 19.52,38.37 19.52,42.09
  Bottom 0.406: v10.35,29.2 10.35,22.6 4.56,16.81 U$1.RST
IO12
  Top 0.305: RN3.3 18.4,25 19.47,26.07 IC7.IO12 19.47,27.63
  Top 0.406: 19.47,27.63 17.75,29.35 11.65,29.35 10.5,28.2 10.5,24.7 5.15,19.35 U$1.MISO
IO13  (via drill 0.35)
  Top 0.305: v19.65,24.3 20,23.95 RN3.1
  Top 0.406: v19.65,24.3 21.47,26.12 IC7.IO13
  Bottom 0.406: U$1.MOSI 19.65,14.81 v19.65,24.3
IO14
  Top 0.305: 17.47,27.63 IC7.IO14 17.6,26.91 RN3.4
  Top 0.406: U$1.SCLK 22.66,14.2 20.5,14.2 12.5,22.2 12.5,28.25 12.85,28.6 16.5,28.6 17.47,27.63
IO15  (via drill 0.35)
  Top 0.305: RN2.4 20.8,42.71 IC7.IO15
  Top 0.406: v20.8,38.4 21.47,39.07 IC7.IO15
  Bottom 0.305: 20.9,38.3 v20.8,38.4
  Bottom 0.406: U$1.CS 22.23,16.81 20.9,18.14 20.9,38.3
N$1
  Top 1.016: D1.1 54.35,29.9 IC1.2 61,29.9 61.8,30.7 61.8,33.2 58.85,36.15 L2.1
N$2
  Top 0.406: C4.2 72.53,62.12 IC4.8
  Top 0.61: IC4.8 71.61,60.3 70.65,59.35 70.65,55.25 71.1,54.8 R1.1
N$3
  Top 0.305: IC4.6 71.81,57.77 71.35,57.3 71.35,55.85 72.15,55.05 72.15,53.85 73.15,52.85
  Top 0.406: R6.2 73.15,52.85
N$4
  Top 0.406: C3.2 72.5,67.83 IC3.8
  Top 0.61: IC3.8 71.72,67.81 69.08,65.16 69.08,63.88 68.4,63.2 68.4,55.75 67.1,54.45 R4.1
N$5
  Top 0.305: R5.1 69.05,54.6 69.15,54.7 69.15,62.49 71.92,65.27
  Top 0.406: IC3.6 71.92,65.27
N$6
  Top 0.305: 72.88,63.99 73.83,63.04 73.83,55.13 R6.1
  Top 0.406: 72.88,63.99 IC3.5
N$8
  Top 0.406: U$4.2 61.23,65.97 62.25,64.95 R3.2
N$9
  Top 0.406: U$3.2 48.75,66.2 50.1,67.55 62.1,67.55 62.65,67 R2.2
N$11
  Top 0.406: R7.2 61.85,61.7 49.8,61.7 48.75,60.65 U$5.2
N$13
  Top 0.406: U$6.2 61.13,60.85 R8.2
N$15
  Top 0.406: R9.2 62.1,57.8 62.1,56.1 61.75,55.75 50.5,55.75 48.77,54.02 U$7.2
N$17
  Top 0.406: R10.2 63.05,55.07 62,54.02 U$8.2
N$20
  Top 0.61: IC2.2 43.3,26.4
  Top 1.27: L1.1 46.85,36.15 49.5,33.5 49.5,29.5 D8.1 46.4,26.4 43.3,26.4
NEOPIXEL  (via drill 0.35)
  Top 0.254: R5.2 69.65,52.75 70.5,53.6 71.69,53.6 72.15,53.15 72.15,51.45
  Top 0.305: RN2.2 19.2,44.6 v18.95,44.35
  Top 0.508: v18.95,44.35 17.47,42.87 IC7.IO0
  Top 0.61: FLASH.1 12.65,73.8 12.65,56.1 v12.75,56 18.9,49.85 26.8,49.85 27.85,48.8 48.25,48.8 57.25,39.8 v61.6,39.8 | 72.15,51.45 72.15,42 71.15,41 65,41 v64.95,40.95
  Bottom 0.61: v61.6,39.8 62.75,40.95 v64.95,40.95
  Bottom 1.016: v12.75,56 12.75,53 18.95,46.8 v18.95,44.35
RST  (via drill 0.35)
  Top 0.305: RN2.1 18.38,45.85 18.38,45.77 v16.8,44.2 16.5,43.9 16.5,36.5 9.47,29.47 IC7.RST
  Top 0.61: RESET.1 8.66,63.65 11.25,61.21 v11.25,57.5
  Bottom 0.61: v11.25,57.5 11.2,57.45 11.2,49.8 v16.8,44.2
RX
  Top 0.305: IC7.RXD/IO3 11.47,42.33 10.1,43.7 6.6,43.7 4.1,46.2 4.1,63.79 PROGRAMMING.2
SCL
  Top 0.305: J3.1 6.96,54.79 7.81,53.94 7.81,53.11 4.6,49.9 4.6,47.15 5.53,46.22 J2.1
  Top 0.61: J2.1 10.38,46.22 13.47,43.13 IC7.IO5
SDA
  Top 0.305: J2.2 6.2,47.2 5.55,47.2 5.1,47.65 5.1,49.7 8.4,53 8.4,54.33 6.94,55.79 J3.2
  Top 0.61: J2.2 11.58,47.22 15.47,43.33 IC7.IO4
TX
  Top 0.305: IC7.TXD/IO1 9.47,42.45 8.89,43.03 6.27,43.03 3.6,45.7 3.6,61.05 2.08,62.57 PROGRAMMING.1
VDD
  Bottom 4.572: POWER-EXT.1 58.04,75.8
  Bottom 5.08: 50.25,11.05 50.25,10.25 J1.PWR
  Bottom 6.096: 58.04,75.8 62.9,75.8 70.85,67.85 70.85,31.65 50.25,11.05
  pour Top (no thermals): 41.8,25.4 47.9,25.4 50.3,27.8 50.3,33 51,33.7 59.35,33.7 60.65,32.4 60.65,31 52.9,31 52,30.1 52,24.2 61.15,15.05 61.15,13.8 56.8,13.8 50.8,7.8 49.2,7.8 43.2,13.8 38.9,13.8 38.7,14 38.7,16 45.8,23.1 45.8,24.1 41.9,24.1 41.7,24.3 41.7,25.3

### Text on the board
tPlace: FLASH | GND | VIN | WS2811 | GND | 4 | 3 | 2 | 1 | 6 | 5 | RN1 | INPUT = 9-35v / OUTPUT = VIN | C3 | RX | RESET | TX | FET6 | FET4 | FET2 | C4 | 470R | FET5 | FET3 | FET1 | RN4 | Austin's Creations / Tower Controller / V2.0.0 | 330MT | 100R | 470R | 100R | 33R | 220Uf - 6.3V | 220Uf - 6.3V | RN2 | C6 | C2 | LM2596S - 3.3V | LM2596S - 5V | D1 | D8 | RN3 | C1 | C5 | 680Uf-35V | 680Uf-35V | INPUT = 9-35v